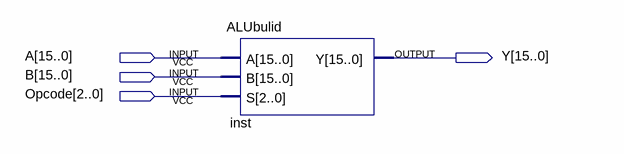
[diagram p0: schematic sheet]
// Quartus schematic ALU.bdf as structural Verilog: 1 symbols, 4 pins
module ALU (
  input  [15:0] A,
  input  [15:0] B,
  input  [2:0] Opcode,
  output [15:0] Y
);

  ALUbulid inst (.A(A), .B(B), .S(Opcode), .Y(Y));
endmodule
